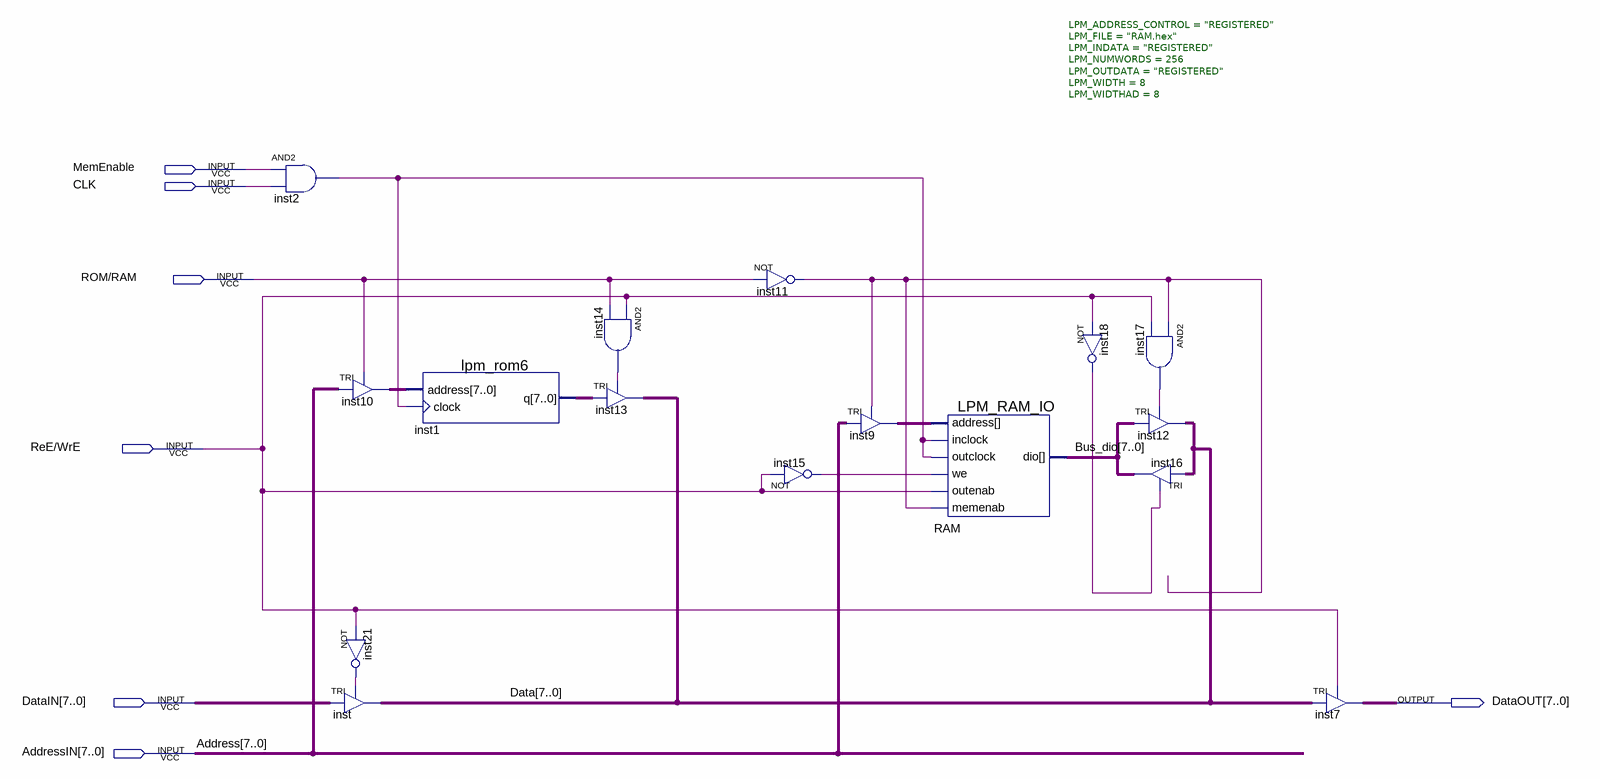
[diagram p0: schematic sheet]
// Quartus schematic ROM_RAM.bdf as structural Verilog: 16 symbols, 7 pins
module ROM_RAM (
  input  MemEnable,
  input  CLK,
  input  \ROM/RAM ,
  input  \ReE/WrE ,
  input  [7:0] DataIN,
  input  [7:0] AddressIN,
  output [7:0] DataOUT
);

  wire inst2_out, inst11_out, inst14_out, inst15_out, inst17_out, inst18_out, inst21_out;
  wire [7:0] Bus_dio, Data, inst1_q, inst9_out, inst10_out;

  and inst2 (inst2_out, MemEnable, CLK);
  TRI inst10[7:0] (.IN(AddressIN), .OE(\ROM/RAM ), .OUT(inst10_out));
  not inst21 (inst21_out, \ReE/WrE );
  TRI inst[7:0] (.IN(DataIN), .OE(inst21_out), .OUT(Data));
  lpm_rom6 inst1 (.address(inst10_out), .clock(inst2_out), .q(inst1_q));
  and inst14 (inst14_out, \ReE/WrE , \ROM/RAM );
  TRI inst13[7:0] (.IN(inst1_q), .OE(inst14_out), .OUT(Data));
  not inst11 (inst11_out, \ROM/RAM );
  not inst15 (inst15_out, \ReE/WrE );
  TRI inst9[7:0] (.IN(AddressIN), .OE(inst11_out), .OUT(inst9_out));
  LPM_RAM_IO #(.LPM_ADDRESS_CONTROL("REGISTERED"), .LPM_FILE("RAM.hex"), .LPM_INDATA("REGISTERED"), .LPM_NUMWORDS(256), .LPM_OUTDATA("REGISTERED"), .LPM_WIDTH(8), .LPM_WIDTHAD(8)) RAM (
    .address(inst9_out), .outclock(inst2_out), .memenab(inst11_out), .inclock(inst2_out), .we(inst15_out),
    .outenab(\ReE/WrE ), .dio(Bus_dio));
  not inst18 (inst18_out, \ReE/WrE );
  and inst17 (inst17_out, inst11_out, \ReE/WrE );
  TRI inst12[7:0] (.IN(Bus_dio), .OE(inst17_out), .OUT(Data));
  TRI inst16[7:0] (.IN(Data), .OE(inst18_out), .OUT(Bus_dio));
  TRI inst7[7:0] (.IN(Data), .OE(\ReE/WrE ), .OUT(DataOUT));

  // Other names for the same wires on the sheet: Address[7:0] = AddressIN
endmodule
